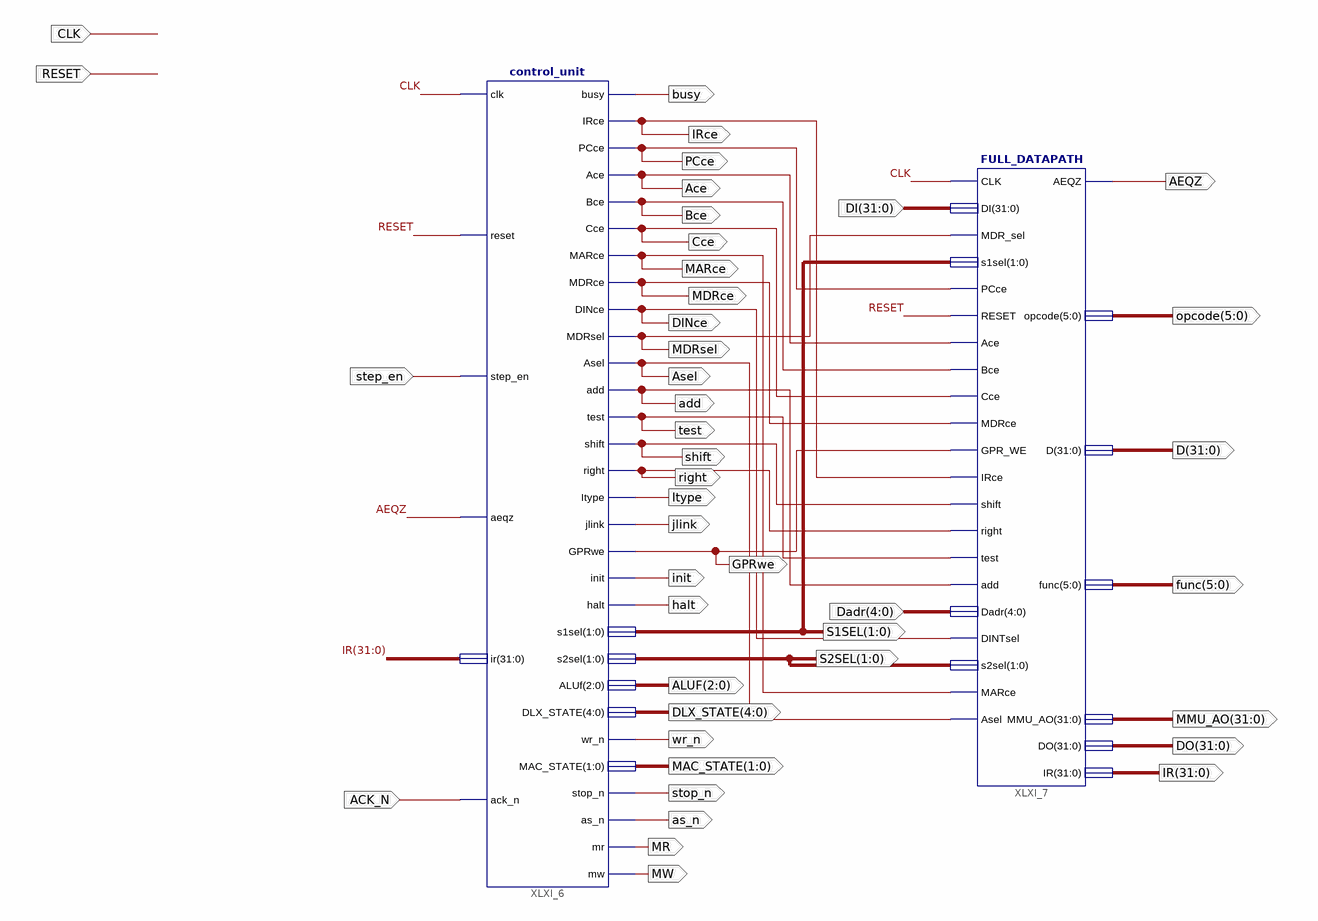
[diagram p0: schematic sheet 1]
// Xilinx ISE schematic DLX.sch (spartan6) as structural Verilog: 2 symbols, 43 ports
module DLX (
  input  CLK,
  input  RESET,
  input  [31:0] DI,
  input  [4:0] Dadr,
  input  step_en,
  input  ACK_N,
  output AEQZ,
  output add,
  output test,
  output shift,
  output right,
  output Ace,
  output Bce,
  output Cce,
  output PCce,
  output MDRce,
  output MDRsel,
  output MARce,
  output DINce,
  output Asel,
  output IRce,
  output [5:0] func,
  output [31:0] MMU_AO,
  output [31:0] D,
  output [5:0] opcode,
  output [1:0] S1SEL,
  output [1:0] S2SEL,
  output Itype,
  output jlink,
  output init,
  output halt,
  output [2:0] ALUF,
  output [4:0] DLX_STATE,
  output wr_n,
  output [1:0] MAC_STATE,
  output stop_n,
  output as_n,
  output [31:0] DO,
  output [31:0] IR,
  output GPRwe,
  output busy,
  output MR,
  output MW
);

  control_unit XLXI_6 (
    .clk(CLK), .reset(RESET), .step_en(step_en), .aeqz(AEQZ), .ir(IR), .ack_n(ACK_N), .busy(busy),
    .IRce(IRce), .PCce(PCce), .Ace(Ace), .Bce(Bce), .Cce(Cce), .MARce(MARce), .MDRce(MDRce), .DINce(DINce),
    .MDRsel(MDRsel), .Asel(Asel), .add(add), .test(test), .shift(shift), .right(right), .Itype(Itype),
    .jlink(jlink), .GPRwe(GPRwe), .init(init), .halt(halt), .s1sel(S1SEL), .s2sel(S2SEL), .ALUf(ALUF),
    .DLX_STATE(DLX_STATE), .wr_n(wr_n), .MAC_STATE(MAC_STATE), .stop_n(stop_n), .as_n(as_n), .mr(MR), .mw(MW));
  FULL_DATAPATH XLXI_7 (
    .CLK(CLK), .DI(DI), .MDR_sel(MDRsel), .s1sel(S1SEL), .PCce(PCce), .RESET(RESET), .Ace(Ace), .Bce(Bce),
    .Cce(Cce), .MDRce(MDRce), .GPR_WE(GPRwe), .IRce(IRce), .shift(shift), .right(right), .test(test),
    .add(add), .Dadr(Dadr), .DINTsel(DINce), .s2sel(S2SEL), .MARce(MARce), .Asel(Asel), .AEQZ(AEQZ),
    .opcode(opcode), .D(D), .func(func), .MMU_AO(MMU_AO), .DO(DO), .IR(IR));
endmodule
